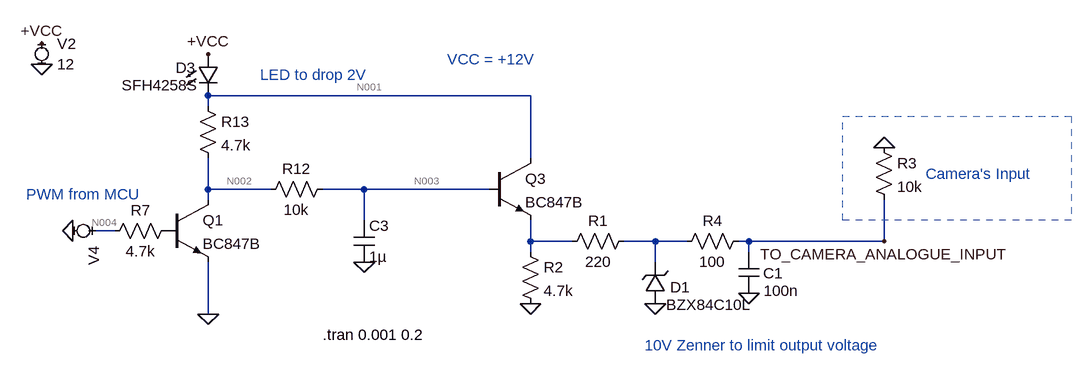
[diagram p0: schematic Ian_ADT7422_Converter.asc]
Ian_ADT7422_Converter.asc, the LTspice schematic file:
Version 4
SHEET 1 880 680
WIRE -368 -736 -864 -736
WIRE -864 -720 -864 -736
WIRE -368 -640 -368 -736
WIRE -864 -592 -864 -640
WIRE -768 -592 -864 -592
WIRE -624 -592 -688 -592
WIRE -432 -592 -624 -592
WIRE -864 -576 -864 -592
WIRE -624 -544 -624 -592
WIRE -1008 -528 -1040 -528
WIRE -368 -512 -368 -544
WIRE -304 -512 -368 -512
WIRE -176 -512 -224 -512
WIRE -128 -512 -176 -512
WIRE -32 -512 -48 -512
WIRE 176 -512 176 -576
WIRE 176 -512 -32 -512
WIRE -368 -496 -368 -512
WIRE -32 -496 -32 -512
WIRE -176 -480 -176 -512
WIRE -864 -400 -864 -480
FLAG -1120 -784 0
FLAG -1120 -816 +VCC
FLAG -1072 -528 0
FLAG -864 -800 +VCC
FLAG -624 -480 0
FLAG -368 -416 0
FLAG -176 -416 0
FLAG 176 -512 TO_CAMERA_ANALOGUE_INPUT
FLAG -864 -400 0
FLAG 176 -656 0
FLAG -32 -432 0
SYMBOL MiniSyms4\\voltage- -1120 -800 R0
WINDOW 123 0 0 Left 2
WINDOW 39 0 0 Left 2
SYMATTR InstName V2
SYMATTR Value 12
SYMBOL MiniSyms4\\voltage- -1056 -528 R90
WINDOW 3 11 11 Invisible 2
WINDOW 123 0 0 Left 2
WINDOW 39 0 0 Left 2
SYMATTR Value PULSE(3.3 0 0 0 0 0.08e-3 0.2e-3)
SYMATTR InstName V4
SYMBOL res -912 -544 R90
WINDOW 0 0 56 VBottom 2
WINDOW 3 32 56 VTop 2
SYMATTR InstName R7
SYMATTR Value 4.7k
SYMBOL npn -928 -576 R0
SYMATTR InstName Q1
SYMATTR Value BC847B
SYMBOL res -880 -736 R0
SYMATTR InstName R13
SYMATTR Value 4.7k
SYMBOL res -672 -608 R90
WINDOW 0 0 56 VBottom 2
WINDOW 3 32 56 VTop 2
SYMATTR InstName R12
SYMATTR Value 10k
SYMBOL cap -640 -544 R0
SYMATTR InstName C3
SYMATTR Value 1µ
SYMBOL res -384 -512 R0
SYMATTR InstName R2
SYMATTR Value 4.7k
SYMBOL npn -432 -640 R0
SYMATTR InstName Q3
SYMATTR Value BC847B
SYMBOL zener -160 -416 R180
WINDOW 0 -38 25 Left 2
WINDOW 3 -132 -2 Left 2
SYMATTR InstName D1
SYMATTR Value BZX84C10L
SYMATTR Type tvsdiode
SYMBOL res -208 -528 R90
WINDOW 0 0 56 VBottom 2
WINDOW 3 32 56 VTop 2
SYMATTR InstName R1
SYMATTR Value 220
SYMBOL res -32 -528 R90
WINDOW 0 0 56 VBottom 2
WINDOW 3 32 56 VTop 2
SYMATTR InstName R4
SYMATTR Value 100
SYMBOL LED -880 -800 R0
WINDOW 0 -34 21 Left 2
WINDOW 3 -117 48 Left 2
SYMATTR InstName D3
SYMATTR Value SFH4258S
SYMBOL res 160 -672 R0
SYMATTR InstName R3
SYMATTR Value 10k
SYMBOL cap -48 -496 R0
WINDOW 0 38 33 Left 2
WINDOW 3 39 60 Left 2
SYMATTR InstName C1
SYMATTR Value 100n
TEXT -688 -368 Left 2 !.tran 0.001 0.2
TEXT -1144 -584 Left 2 ;PWM from MCU
TEXT -192 -352 Left 2 ;10V Zenner to limit output voltage
TEXT -496 -792 Left 2 ;VCC = +12V
TEXT -784 -768 Left 2 ;LED to drop 2V
TEXT 240 -616 Left 2 ;Camera's Input
RECTANGLE Normal 464 -544 112 -704 2

The netlist it stands for:
* Ian_ADT7422_Converter.asc
V2 +VCC 0 12
V4 N004 0 PULSE(3.3 0 0 0 0 0.08e-3 0.2e-3)
R7 P001 N004 4.7k
Q1 N002 P001 0 0 BC847B
R13 N001 N002 4.7k
R12 N003 N002 10k
C3 N003 0 1µ
R2 N005 0 4.7k
Q3 N001 N003 N005 0 BC847B
D1 0 N006 BZX84C10L
R1 N006 N005 220
R4 TO_CAMERA_ANALOGUE_INPUT N006 100
D3 +VCC N001 SFH4258S
R3 0 TO_CAMERA_ANALOGUE_INPUT 10k
C1 TO_CAMERA_ANALOGUE_INPUT 0 100n
.model D D
.lib standard.dio
.model NPN NPN
.model PNP PNP
.lib standard.bjt
.tran 0.001 0.2
* PWM from MCU
* 10V Zenner to limit output voltage
* VCC = +12V
* LED to drop 2V
* Camera's Input
.backanno
.end

* Results of the author's LTspice run, read from the files saved beside the schematic
* Operating Point, zero values left out:
*   V(+vcc) = 12 V
*   V(n004) = 3.3 V
*   V(p001) = 690.4 mV
*   V(n002) = 16.75 mV
*   V(n001) = 9.471 V
*   V(n003) = 16.75 mV
*   Ic(Q3) = 19.48 pA
*   Ib(Q3) = -19.42 pA
*   Ic(Q1) = 2.012 mA
*   Ib(Q1) = 555.2 µA
*   Ie(Q1) = -2.567 mA
*   I(D3) = 2.012 mA
*   I(R12) = 19.42 pA
*   I(R13) = 2.012 mA
*   I(R7) = -555.2 µA
*   I(V4) = -555.2 µA
*   I(V2) = -2.012 mA